# EAGLE design zerog_accelerometer_featherwing (EAGLE 8.0.0)
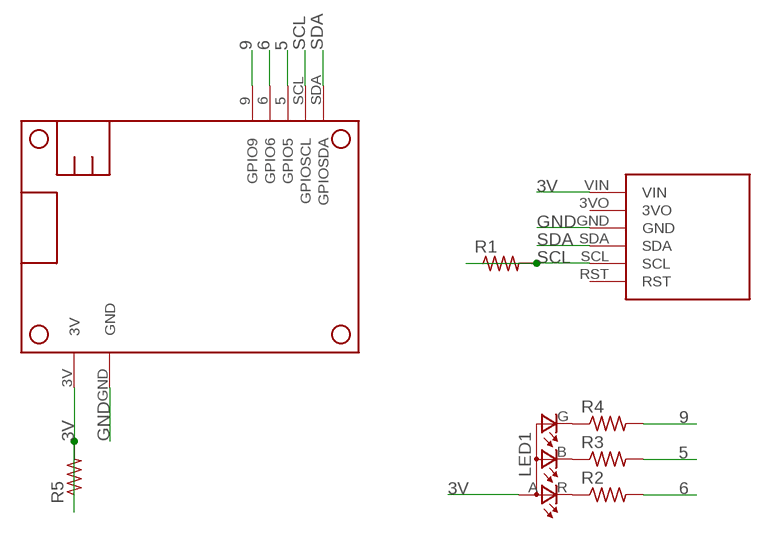
[diagram p0: schematic, sheet 1]

## Parts
LED1  LEDRGBOLD  [P-LCC-4-3]
R1  RES-US1206FAB  [R1206FAB]
R2  RES-US1206FAB  [R1206FAB]
R3  RES-US1206FAB  [R1206FAB]
R4  RES-US1206FAB  [R1206FAB]
R5  RES-US1206FAB  [R1206FAB]
U$1  FEATHERWING_I2C  [FEATHERWING_I2C]
U$2  BNO055_BREAKOUT  [BNO055_BREAKOUT]

## Nets
3V: LED1.A(A2) R5.1 R5.2 U$1.3V U$2.VIN
5: R3.2 U$1.5(GPIO5)
6: R2.2 U$1.6(GPIO6)
9: R4.2 U$1.9(GPIO9)
GND: U$1.GND U$2.GND
N$2: LED1.R(CRED) R2.1
N$3: LED1.B(CBLUE) R3.1
N$4: LED1.G(CGREEN) R4.1
SCL: R1.1 R1.2 U$1.SCL(GPIOSCL) U$2.SCL
SDA: U$1.SDA(GPIOSDA) U$2.SDA
Unconnected: U$2.3VO U$2.RST

## Library data of the parts
LED1 = fab:LEDRGBOLD: OSRAM Hyper Multi TOPLED® Hyper-Bright LED LATB T686 Source: http://www.osram.convergy.de/
R1-R5 = fab:RES-US: Resistor (US Symbol) Variants with postfix FAB are widened to allow the routing of internal traces
U$1 = adafruit:FEATHERWING_I2C
U$2 = will:BNO055_BREAKOUT

## Board
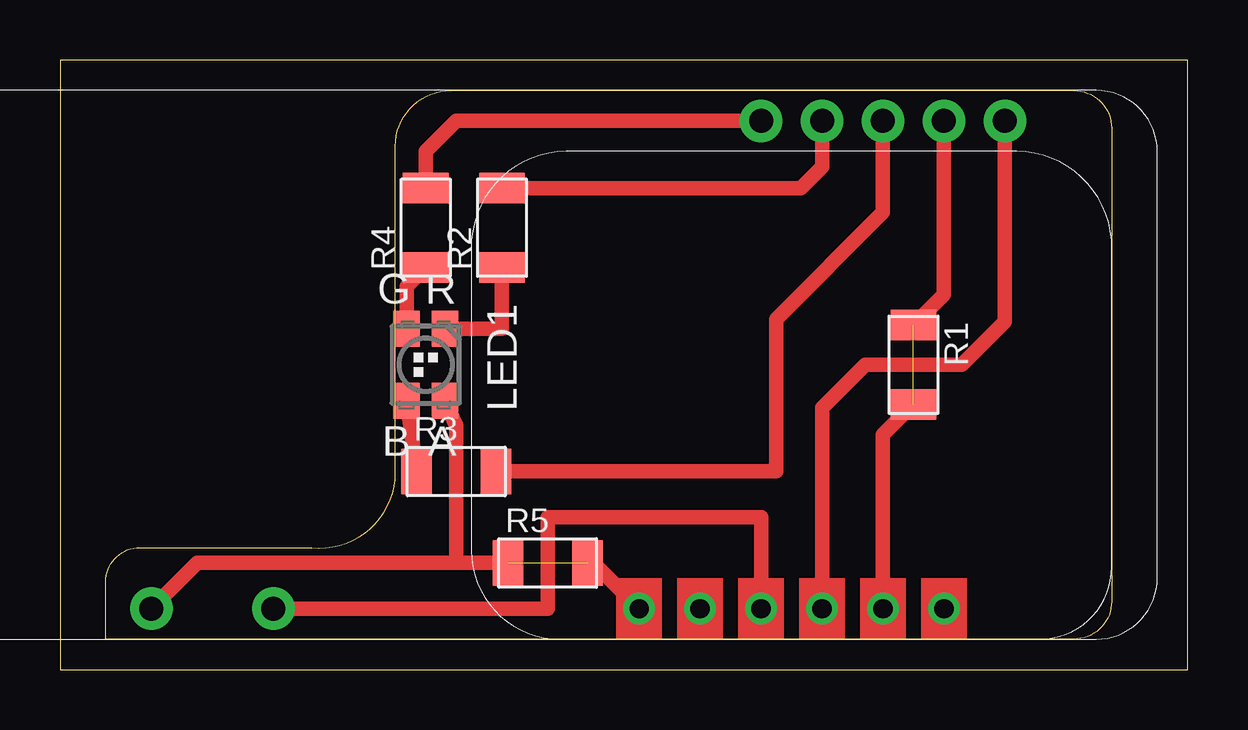
[diagram p1: board, top side]

Size 46.99 x 25.4 mm. Coordinates in mm from the lower left corner, seen from the top.
Outline: 0,0 46.99,0 46.99,25.4 0,25.4 0,0
Copper layers (1*16): Top 0.035mm / dielectric 1.5mm / Bottom 0.035mm
Design rules "default": minimum track width 10mil, minimum drill 24mil, track to track 8mil, track to pad 8mil, pad to pad 8mil, via to via 8mil, smd to smd 8mil, copper to edge 40mil, drill to drill 8mil, minimum pad ring 10mil, minimum via ring 8mil, stop-mask expansion 4mil, vias tented up to drill 0mil, thermal gap 10mil
Milling: area 1.9,1.3 to 43.8,24.1

### Footprints (pad centres in the part's own frame; a part is rotated, then mirrored left to right if it is on the bottom)
P-LCC-4-3 = smd 1.1 x 1.5: A -0.8,1.5; B 0.8,1.5; G 0.8,-1.5; R -0.8,-1.5
R1206FAB = smd 1.27 x 1.905: 1 -1.651,0; 2 1.651,0
FEATHERWING_I2C = drill 1 pad 1.778: 3V 8.89,1.27; 5 39.37,21.59; 6 36.83,21.59; 9 34.29,21.59; GND 13.97,1.27; SCL 41.91,21.59; SDA 44.45,21.59
BNO055_BREAKOUT = drill 0.8: 3VO -8.89,5.08; GND -8.89,2.54; RST -8.89,-5.08; SCL -8.89,-2.54; SDA -8.89,0; VIN -8.89,7.62

### Placement (x,y rotation side)
LED1  15.24,12.7 180 top
R1  35.56,12.7 270 top
R2  18.41,18.41 90 top
R3  16.51,8.26 0 top
R4  15.24,18.41 90 top
R5  20.32,4.45 0 top
U$1  -5.08,1.27 0 top
U$2  31.75,11.43 90 top

### Tracks (layer width: path | path; a pad name or v marks a point on that pad's centre or on a via)
3V  (1 unrouted)
  Top 0.61: LED1.A 16.51,10.16 16.51,4.45 | R5.1 16.51,4.45 | U$1.3V 5.71,4.45 16.51,4.45 | R5.2 22.23,4.45 U$2.VIN
5
  Top 0.61: R3.2 29.84,8.26 29.84,14.61 34.29,19.05 U$1.5
6
  Top 0.61: R2.2 30.86,20.07 31.75,20.95 U$1.6
9
  Top 0.61: R4.2 15.24,21.59 16.51,22.86 U$1.9
GND
  Top 0.61: U$2.GND 29.21,6.35 20.32,6.35 20.32,2.54 U$1.GND
N$2
  Top 0.61: LED1.R 18.41,14.2 R2.1
N$3
  Top 0.61: LED1.B R3.1
N$4
  Top 0.61: LED1.G 14.44,15.96 R4.1
SCL  (1 unrouted)
  Top 0.61: U$2.SCL 34.29,9.78 R1.2 | R1.1 36.83,15.62 U$1.SCL
SDA
  Top 0.61: U$1.SDA 39.37,14.5 37.57,12.7 33.55,12.7 31.75,10.9 U$2.SDA
(copper drawn outside any net)
  shapes: Top area x6